# Altium schematic sheet PD_Controller_TI.SchDoc
size A4
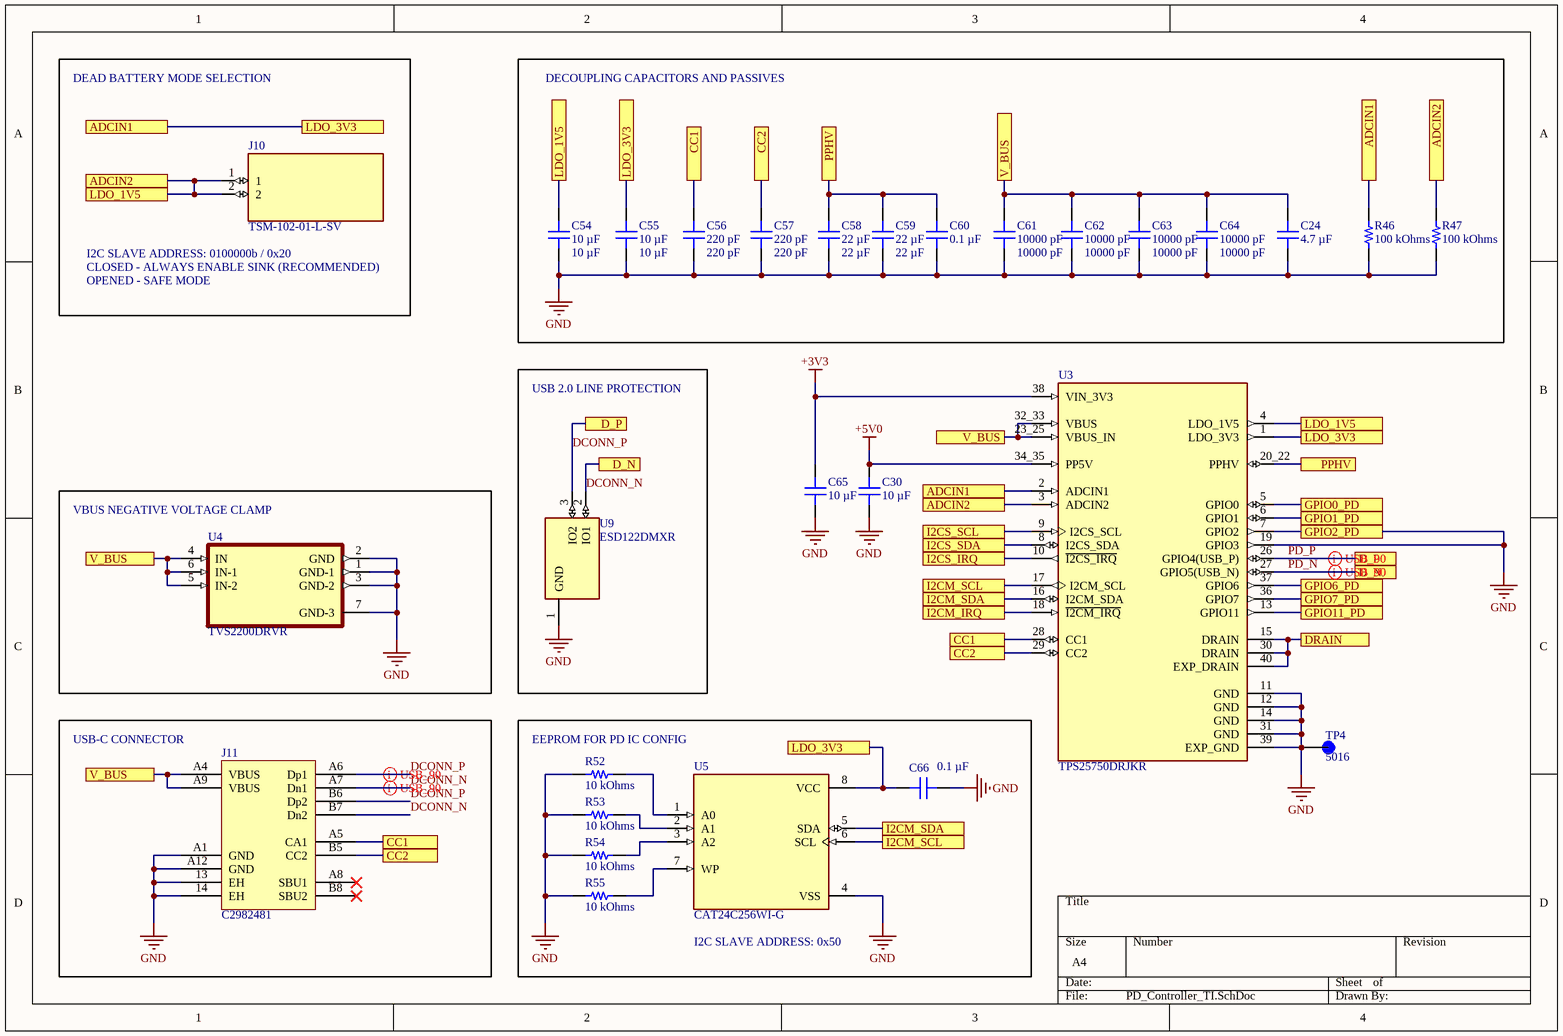
[diagram p0: PD_Controller_TI.SchDoc]

## Parts
C24  4.7 µF  [CAP 0603_1608]
C30  10 µF  [CAP 0402_1005]
C54  10 µF  [CAP 0402_1005]
C55  10 µF  [CAP 0402_1005]
C56  220 pF  [CAP 0402_1005]
C57  220 pF  [CAP 0402_1005]
C58  22 µF  [CAP 0805_2012]
C59  22 µF  [CAP 0805_2012]
C60  0.1 µF  [CAP 0402_1005]
C61  10000 pF  [CAP 0402_1005]
C62  10000 pF  [CAP 0402_1005]
C63  10000 pF  [CAP 0402_1005]
C64  10000 pF  [CAP 0402_1005]
C65  10 µF  [CAP 0402_1005]
C66  0.1 µF  [CAP 0402_1005]
J10  TSM-102-01-L-SV  [TSM-102-01-L-SV]  (no BOM)
J11  C2982481  [GT-USB-7079A]
R46  100 kOhms  [RES 0402_1005]
R47  100 kOhms  [RES 0402_1005]
R52  10 kOhms  [RES 0402_1005]
R53  10 kOhms  [RES 0402_1005]
R54  10 kOhms  [RES 0402_1005]
R55  10 kOhms  [RES 0402_1005]
TP4  5016  [KEYSTONE_5016]  (no BOM)
U3  TPS25750DRJKR  [IC_TPS25750DRJKR]
U4  TVS2200DRVR  [SON65P200X200X80-7N]
U5  CAT24C256WI-G  [SOIC127P600X175-8N]
U9  ESD122DMXR  [IC_ESD122DMXR]

## Blocks framed on the sheet
DECOUPLING CAPACITORS AND PASSIVES: C24 C54-C64 R46 R47
USB 2.0 LINE PROTECTION: U9
VBUS NEGATIVE VOLTAGE CLAMP: U4
USB-C CONNECTOR: J11

## Ports
ADCIN1, ADCIN2, CC1, CC2, D_N, D_P, DRAIN, GPIO0_PD, GPIO1_PD, GPIO2_PD, GPIO6_PD, GPIO7_PD, GPIO11_PD, I2CM_IRQ, I2CM_SCL, I2CM_SDA, I2CS_IRQ, I2CS_SCL, I2CS_SDA, LDO_1V5, LDO_3V3, PPHV, V_BUS

## Nets
+3V3: C65.1 U3.38(VIN_3V3)
+5V0: C30.1 U3.34_35(PP5V)
GND: C24.1 C30.2 C54.1 C55.1 C56.2 C57.2 C58.1 C59.1 C60.2 C61.1 C62.1 C63.1 C64.1 C65.2 C66.1 J11.13(EH) J11.14(EH) J11.A1(GND) J11.A12(GND) R46.1 R47.1 R52.2 R53.2 R54.2 R55.2 TP4.TP U3.7(GPIO2) U3.11(GND) U3.12(GND) U3.14(GND) U3.19(GPIO3) U3.31(GND) U3.39(EXP_GND) U4.1(GND-1) U4.2(GND) U4.3(GND-2) U4.7(GND-3) U5.4(VSS) U9.1(GND) ; port GPIO2_PD
ADCIN1: C55.2 C66.2 R46.2 U3.1(LDO_3V3) U3.2(ADCIN1) U5.8(VCC) ; port LDO_3V3, port ADCIN1
ADCIN2: C54.2 J10.1 J10.2 R47.2 U3.3(ADCIN2) U3.4(LDO_1V5) ; port LDO_1V5, port ADCIN2
CC1: C56.1 J11.A5(CA1) U3.28(CC1) ; port CC1
CC2: C57.1 J11.B5(CC2) U3.29(CC2) ; port CC2
DCONN_N: J11.A7(Dn1) J11.B7(Dn2) U3.27(GPIO5(USB_N)) U9.2(IO1) ; port D_N  [also labelled PD_N]
DCONN_P: J11.A6(Dp1) J11.B6(Dp2) U3.26(GPIO4(USB_P)) U9.3(IO2) ; port D_P  [also labelled PD_P]
DRAIN: U3.15(DRAIN) U3.30(DRAIN) U3.40(EXP_DRAIN) ; port DRAIN
GPIO0_PD: U3.5(GPIO0) ; port GPIO0_PD
GPIO1_PD: U3.6(GPIO1) ; port GPIO1_PD
GPIO6_PD: U3.37(GPIO6) ; port GPIO6_PD
GPIO7_PD: U3.36(GPIO7) ; port GPIO7_PD
GPIO11_PD: U3.13(GPIO11) ; port GPIO11_PD
I2CM_IRQ: U3.18(~{I2CM_IRQ}) ; port I2CM_IRQ
I2CM_SCL: U3.17(I2CM_SCL) U5.6(SCL) ; port I2CM_SCL
I2CM_SDA: U3.16(I2CM_SDA) U5.5(SDA) ; port I2CM_SDA
I2CS_IRQ: U3.10(~{I2CS_IRQ}) ; port I2CS_IRQ
I2CS_SCL: U3.9(I2CS_SCL) ; port I2CS_SCL
I2CS_SDA: U3.8(I2CS_SDA) ; port I2CS_SDA
PPHV: C58.2 C59.2 C60.1 U3.20_22(PPHV) ; port PPHV
V_BUS: C24.2 C61.2 C62.2 C63.2 C64.2 J11.A4(VBUS) J11.A9(VBUS) U3.23_25(VBUS_IN) U3.32_33(VBUS) U4.4(IN) U4.5(IN-2) U4.6(IN-1) ; port V_BUS
NetR52_1: R52.1 U5.1(A0)
NetR53_1: R53.1 U5.2(A1)
NetR54_1: R54.1 U5.3(A2)
NetR55_1: R55.1 U5.7(WP)

Not connected (* = marked no-connect by the designer): J11 A8(SBU1)* B8(SBU2)*

## Layout directives
differential pair; differential pair class USB_90: DCONN_N, DCONN_P

## Notes on the sheet
- DEAD BATTERY MODE SELECTION
- CLOSED - ALWAYS ENABLE SINK (RECOMMENDED)
- OPENED - SAFE MODE
- I2C SLAVE ADDRESS: 0100000b / 0x20
- (near R52) EEPROM FOR PD IC CONFIG
- (near U5) I2C SLAVE ADDRESS: 0x50

## Library data of the parts
C24 = C1608X5R1V475K080AC: CAP CER 4.7UF 35V X5R 0603; manufacturer: TDK Corporation; Tolerance: ±10%; Part Number: C1608X5R1V475K080AC; Value: 4.7 µF; Applications: General Purpose; Capacitance: 4.7 µF; componentlink1description: Datasheet; componentlink1url: https://product.tdk.com/info/en/catalog/datasheets/mlcc_commercial_general_en.pdf?ref_disty=digikey; componentlink2description: DigiKey Link; componentlink2url: https://www.digikey.com/en/products/detail/tdk-corporation/C1608X5R1V475K080AC/3648577; Device Package: 0603 (1608 Metric); Features: Low ESL; lastupdated: 9/05/2023 7:14:01 PM; Lifecycle Status: Active; Minimum Order: 1; Mounting Type: Surface Mount, MLCC; Operating Temperature: -55°C ~ 85°C; Package / Case: 0603 (1608 Metric); packaging: TapeAndReel; partid: 2627; Part Status: Active; price: 0.08; series: C; Size / Dimension: 0.063" L x 0.031" W (1.60mm x 0.80mm); Supplier 1: DigiKey; Supplier Part Number 1: 445-9064-1-ND; Temperature Coefficient: X5R; Thickness (Max): 0.039" (1.00mm); Voltage - Rated: 35V
C30 C54 C55 C65 = CL05A106MP8NUB8: CAP CER 10UF 10V X5R 0402; manufacturer: Samsung Electro-Mechanics; Tolerance: ±20%; Part Number: CL05A106MP8NUB8; Value: 10 µF; Applications: Acoustic Noise Reduction; Capacitance: 10 µF; componentlink1description: Datasheet; componentlink1url: http://www.samsungsem.com/kr/support/product-search/mlcc/CL05A106MP8NUB8.jsp; componentlink2description: DigiKey Link; componentlink2url: https://www.digikey.com/en/products/detail/samsung-electro-mechanics/CL05A106MP8NUB8/5961314; Device Package: 0402 (1005 Metric); lastupdated: 26/04/2023 7:02:37 PM; Lifecycle Status: Active; Minimum Order: 1; Mounting Type: Surface Mount, MLCC; Operating Temperature: -55°C ~ 85°C; Package / Case: 0402 (1005 Metric); packaging: TapeAndReel; partid: 1758; Part Status: Active; price: 0.06; series: CL; Size / Dimension: 0.039" L x 0.020" W (1.00mm x 0.50mm); Supplier 1: DigiKey; Supplier Part Number 1: 1276-6830-1-ND; Temperature Coefficient: X5R; Thickness (Max): 0.035" (0.90mm); Voltage - Rated: 10V
C56 C57 = 885012205021: CAP CER 220PF 16V X7R 0402; manufacturer: Würth Elektronik; Tolerance: ±10%; Part Number: 885012205021; Value: 220 pF; Applications: General Purpose; Capacitance: 220 pF; componentlink1description: Datasheet; componentlink1url: https://katalog.we-online.de/pbs/datasheet/885012205021.pdf; componentlink2description: DigiKey Link; componentlink2url: https://www.digikey.com/en/products/detail/würth-elektronik/885012205021/5453371; Device Package: 0402 (1005 Metric); lastupdated: 26/04/2023 7:02:36 PM; Lifecycle Status: Active; Minimum Order: 1; Mounting Type: Surface Mount, MLCC; Operating Temperature: -55°C ~ 125°C; Package / Case: 0402 (1005 Metric); packaging: TapeAndReel; partid: 2015; Part Status: Active; price: 0.01; series: WCAP-CSGP; Size / Dimension: 0.039" L x 0.020" W (1.00mm x 0.50mm); Supplier 1: DigiKey; Supplier Part Number 1: 732-7516-1-ND; Temperature Coefficient: X7R; Thickness (Max): 0.022" (0.55mm); Voltage - Rated: 16V
C58 C59 = C2012X5R1V226M125AC: CAP CER 22UF 35V X5R 0805; manufacturer: TDK Corporation; Tolerance: ±20%; Part Number: C2012X5R1V226M125AC; Value: 22 µF; Applications: General Purpose; Capacitance: 22 µF; componentlink1description: Datasheet; componentlink1url: https://product.tdk.com/info/en/catalog/datasheets/mlcc_commercial_general_en.pdf?ref_disty=digikey; componentlink2description: DigiKey Link; componentlink2url: https://www.digikey.com/en/products/detail/tdk-corporation/C2012X5R1V226M125AC/3951664; Device Package: 0805 (2012 Metric); Features: Low ESL; lastupdated: 26/04/2023 7:09:36 PM; Lifecycle Status: Active; Minimum Order: 1; Mounting Type: Surface Mount, MLCC; Operating Temperature: -55°C ~ 85°C; Package / Case: 0805 (2012 Metric); packaging: TapeAndReel; partid: 45365; Part Status: Active; price: 0.28; series: C; Size / Dimension: 0.079" L x 0.049" W (2.00mm x 1.25mm); Supplier 1: DigiKey; Supplier Part Number 1: 445-14428-1-ND; Temperature Coefficient: X5R; Thickness (Max): 0.057" (1.45mm); Voltage - Rated: 35V
C60 C66 = 885012105001: CAP CER 0.1UF 6.3V X5R 0402; manufacturer: Würth Elektronik; Tolerance: ±20%; Part Number: 885012105001; Value: 0.1 µF; Applications: General Purpose; Capacitance: 0.1 µF; componentlink1description: Datasheet; componentlink1url: https://katalog.we-online.de/pbs/datasheet/885012105001.pdf; componentlink2description: DigiKey Link; componentlink2url: https://www.digikey.com/en/products/detail/würth-elektronik/885012105001/5453333; Device Package: 0402 (1005 Metric); lastupdated: 26/04/2023 7:02:37 PM; Lifecycle Status: Active; Minimum Order: 1; Mounting Type: Surface Mount, MLCC; Operating Temperature: -55°C ~ 85°C; Package / Case: 0402 (1005 Metric); packaging: TapeAndReel; partid: 1931; Part Status: Active; price: 0.01; series: WCAP-CSGP; Size / Dimension: 0.039" L x 0.020" W (1.00mm x 0.50mm); Supplier 1: DigiKey; Supplier Part Number 1: 732-7478-1-ND; Temperature Coefficient: X5R; Thickness (Max): 0.022" (0.55mm); Voltage - Rated: 6.3V
C61-C64 = CGA2B3X7R1V103M050BB: CAP CER 10000PF 35V X7R 0402; manufacturer: TDK Corporation; Tolerance: ±20%; Part Number: CGA2B3X7R1V103M050BB; Value: 10000 pF; Applications: Automotive; Capacitance: 10000 pF; componentlink1description: Datasheet; componentlink1url: https://product.tdk.com/info/en/catalog/datasheets/mlcc_automotive_general_en.pdf?ref_disty=digikey; componentlink2description: DigiKey Link; componentlink2url: https://www.digikey.com/en/products/detail/tdk-corporation/CGA2B3X7R1V103M050BB/3949489; Device Package: 0402 (1005 Metric); lastupdated: 26/04/2023 7:02:37 PM; Lifecycle Status: Active; Minimum Order: 1; Mounting Type: Surface Mount, MLCC; Operating Temperature: -55°C ~ 125°C; Package / Case: 0402 (1005 Metric); packaging: TapeAndReel; partid: 1926; Part Status: Active; price: 0.01; Ratings: AEC-Q200; series: CGA; Size / Dimension: 0.039" L x 0.020" W (1.00mm x 0.50mm); Supplier 1: DigiKey; Supplier Part Number 1: 445-12253-1-ND; Temperature Coefficient: X7R; Thickness (Max): 0.022" (0.55mm); Voltage - Rated: 35V
J10 = TSM-102-01-L-SV: MF: {'manufacturer': u'Samtec Inc.'}; Value: *; Package: None; Price: None; MP: TSM-102-01-L-SV; Availability: Unavailable
J11 = GT-USB-7079A: 5A 1 Surface Mount 16 Female -55℃~+85℃ Type-C SMD USB Connectors ROHS C2982481
R46 R47 = RT0402FRE07100KL: RES SMD 100K OHM 1% 1/16W 0402; Manufacturer: Yageo; Power (Watts): 0.063W, 1/16W; Temperature Coefficient: ±50ppm/°C; Part Number: RT0402FRE07100KL; Value: 100 kOhms; ComponentLink1Description: Datasheet; ComponentLink1URL: https://www.yageo.com/upload/media/product/productsearch/datasheet/rchip/PYu-RT_1-to-0.01_RoHS_L_11.pdf; ComponentLink2Description: DigiKey Link; ComponentLink2URL: https://www.digikey.com/en/products/detail/yageo/RT0402FRE07100KL/1071698; Composition: Thin Film; Device Package: 0402 (1005 Metric); Height - Seated (Max): 0.014" (0.35mm); LastUpdated: 26/04/2023 7:20:40 PM; Lifecycle Status: Active; Minimum Order: 1; Number of Terminations: 2; Operating Temperature: -55°C ~ 155°C; Package / Case: 0402 (1005 Metric); Packaging: TapeAndReel; PartId: 3190; Part Status: Active; Price: 0.01; Resistance: 100 kOhms; Series: RT; Size / Dimension: 0.039" L x 0.020" W (1.00mm x 0.50mm); Supplier 1: DigiKey; Supplier Part Number 1: YAG2307CT-ND; Supplier Device Package: 0402; Tolerance: ±1%
R52-R55 = RC0402JR-1310KL: RES 10K OHM 5% 1/16W 0402; Manufacturer: Yageo; Power (Watts): 0.063W, 1/16W; Temperature Coefficient: ±100ppm/°C; Part Number: RC0402JR-1310KL; Value: 10 kOhms; ComponentLink1Description: Datasheet; ComponentLink1URL: https://www.yageo.com/upload/media/product/productsearch/datasheet/rchip/PYu-RC_Group_51_RoHS_L_11.pdf; ComponentLink2Description: DigiKey Link; ComponentLink2URL: https://www.digikey.com/en/products/detail/yageo/RC0402JR-1310KL/13694115; Composition: Thick Film; Device Package: 0402 (1005 Metric); Features: Moisture Resistant; Height - Seated (Max): 0.016" (0.40mm); LastUpdated: 4/04/2023 7:21:31 PM; Lifecycle Status: Active; Minimum Order: 50000; Number of Terminations: 2; Operating Temperature: -55°C ~ 155°C; Package / Case: 0402 (1005 Metric); PartId: 69237; Part Status: Active; Price: 0; Resistance: 10 kOhms; Series: RC_L; Size / Dimension: 0.039" L x 0.020" W (1.00mm x 0.50mm); Supplier 1: DigiKey; Supplier Part Number 1: 13-RC0402JR-1310KLTR-ND; Supplier Device Package: 0402; Tolerance: ±5%
TP4 = 5016: MF: {'manufacturer': u'Keystone Electronics'}; Package: None; MP: 5016; Value: *; Price: None; Availability: Unavailable
U3 = TPS25750DRJKR: USB, Type-C Controller PMIC 38-WQFN (4x6); MF: {'manufacturer': u'Texas Instruments'}; MP: TPS25750DRJKR; Value: *; Availability: Unavailable; Package: None; Price: None
U4 = TVS2200DRVR: MF: {'manufacturer': u'Texas Instruments'}; MP: TVS2200DRVR; Price: None; Package: None; Availability: Unavailable; Value: *
U5 = CAT24C256WI-G: EEPROM Memory IC 256Kb (32K x 8) IÂ²C 1MHz 500ns 8-SOIC; MF: {'manufacturer': u'ON Semiconductor'}; MP: CAT24C256WI-G; Price: None; Package: None; Availability: Unavailable; Value: *
U9 = ESD122DMXR: 2-channel ESD protection diode for USB Type-C and HDMI 2.0 3-X2SON -40 to 125; MF: {'manufacturer': u'Texas Instruments'}; Package: None; Price: None; Value: *; MP: ESD122DMXR; Availability: Unavailable